# Altium schematic sheet Power.SchDoc
size B
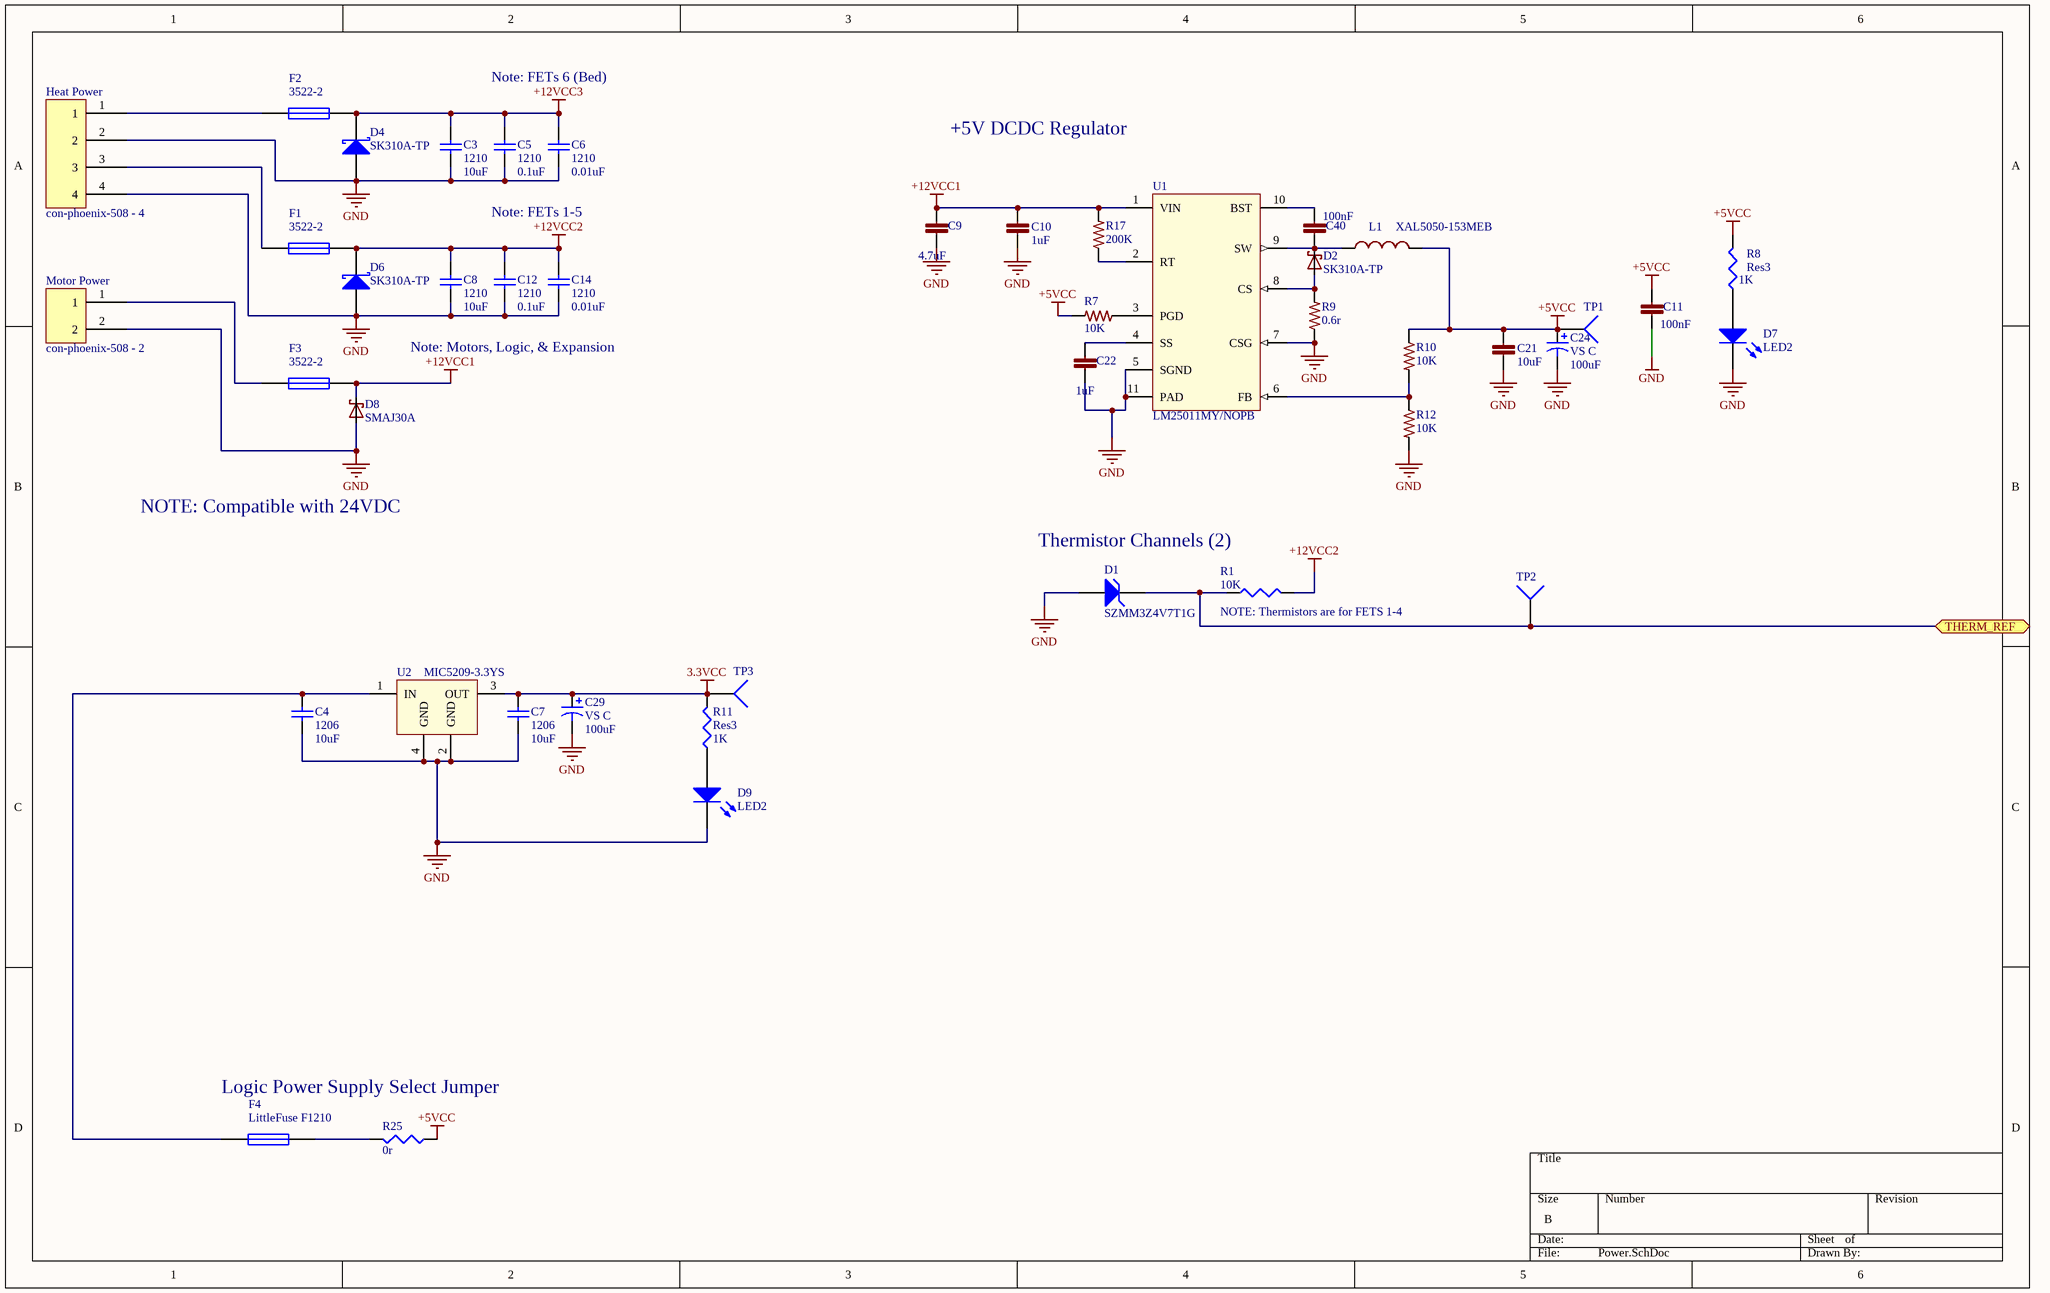
[diagram p0: Power.SchDoc]

## Parts
C3  1210  value 10uF  [C1210]
C4  1206  value 10uF  [C1206]
C5  1210  value 0.1uF  [C1210]
C6  1210  value 0.01uF  [C1210]
C7  1206  value 10uF  [C1206]
C8  1210  value 10uF  [C1210]
C9  4.7uF  [C1206]
C10  1uF  [C0805]
C11  100nF  [C0603]
C12  1210  value 0.1uF  [C1210]
C14  1210  value 0.01uF  [C1210]
C21  10uF  [C0805]
C22  1uF  [C0402]
C24  VS C  value 100uF  [Panasonic VS C]
C29  VS C  value 100uF  [Panasonic VS C]
C40  100nF  [C0603]
D1  SZMM3Z4V7T1G  [SZMM3Z4V7T1G]
D2  SK310A-TP  [SMA-SM]
D4  SK310A-TP  [SK310A-TP]
D6  SK310A-TP  [SK310A-TP]
D7  LED2  [SM 0805 polarized]
D8  SMAJ30A  [SMA-SM]
D9  LED2  [SM 0805 polarized]
F1  3522-2  [3522-2 - WAVE SOLDER]
F2  3522-2  [3522-2 - WAVE SOLDER]
F3  3522-2  [3522-2 - WAVE SOLDER]
F4  LittleFuse F1210  [F1210_M]
Heat_Power  con-phoenix-508 - 4  [MSTBV4]
L1  XAL5050-153MEB  [XAL50xx-153]
Motor_Power  con-phoenix-508 - 2  [MSTBV2 - duplicate]
R1  value 10K  [J1-0603]  (hidden comment: Res3)
R7  10K  [R0603]
R8  Res3  value 1K  [SM 0805 - gap trimmed]
R9  0.6r  [2512R-0.55]
R10  10K  [R0603]
R11  Res3  value 1K  [SM 0805 - gap trimmed]
R12  10K  [R0603]
R17  200K  [R0402]
R25  value 0r  [SM 0805 - gap trimmed]  (hidden comment: Res3)
TP1  TP4  [TP-2]  (value not drawn)
TP2  TP4  [TP-2]  (value not drawn)
TP3  TP4  [TP-2]  (value not drawn)
U1  LM25011MY/NOPB  [VSSOP10]
U2  MIC5209-3.3YS  [SOT230P700X190-4N]

## Ports
THERM_REF

## Nets
3.3VCC: C7.2 C29.1 R11.2 TP3.1 U2.3(OUT)
+5VCC: C11.1 C21.1 C24.1 L1.2 R7.2 R8.2 R10.1 R25.1 TP1.1
+12VCC1: C9.1 C10.1 D8.C F3.2 R17.2 U1.1(VIN)
+12VCC2: C8.2 C12.2 C14.2 D6.2(K) F1.2 R1.2
+12VCC3: C3.2 C5.2 C6.2 D4.2(K) F2.2
GND: C3.1 C4.1 C5.1 C6.1 C7.1 C8.1 C9.2 C10.2 C11.2 C12.1 C14.1 C21.2 C22.2 C24.2 C29.2 D1.1(A) D4.1(A) D6.1(A) D7.1(A) D8.A D9.1(A) Heat_Power.2 Heat_Power.4 Motor_Power.2 R9.1 R12.2 U1.5(SGND) U1.7(CSG) U1.11(PAD) U2.2(GND) U2.4(GND)
THERM_REF: D1.2(K) R1.1 TP2.1 ; port THERM_REF
NetC4_2: C4.2 F4.1 U2.1(IN)
NetC22_1: C22.1 U1.4(SS)
NetC40_1: C40.1 U1.10(BST)
NetC40_2: C40.2 D2.C L1.1 U1.9(SW)
NetD2_A: D2.A R9.2 U1.8(CS)
NetD7_2: D7.2(K) R8.1
NetD9_2: D9.2(K) R11.1
NetF1_1: F1.1 Heat_Power.3
NetF2_1: F2.1 Heat_Power.1
NetF3_1: F3.1 Motor_Power.1
NetF4_2: F4.2 R25.2
NetR7_1: R7.1 U1.3(PGD)
NetR10_2: R10.2 R12.1 U1.6(FB)
NetR17_1: R17.1 U1.2(RT)

## Notes on the sheet
- Note: FETs 6 (Bed)
- +5V DCDC Regulator
- Note: FETs 1-5
- Note: Motors, Logic, & Expansion
- NOTE: Compatible with 24VDC
- Thermistor Channels (2)
- (near R1) NOTE: Thermistors are for FETS 1-4
- Logic Power Supply Select Jumper

## Library data of the parts
C3-C8 C12 C14 = Cap Semi: Capacitor (Semiconductor SIM Model); Published: 8-Jun-2000; LatestRevisionDate: 29-May-2009; LatestRevisionNote: IPC-7351 Footprint Added.; PackageReference: C1206; Publisher: Altium Limited; PackageDescription: Chip Capacitor
C9 = C1206C475K5PACTU: CAP CER 1206 4.7uF 50V 10% X5R; LastRevisionNote: ImportComponents; Published: 23-Apr-2014; Publisher: UltiMachine; LastRevisionDate: 23-Apr-2014; ManufacturerPartNumber: C1206C475K5PACTU; VALUE: 4.7uF
C10 = GRM21BR71H105KA12L: CAP CER 0805 1uF 50V 10% X7R; LastRevisionNote: ImportComponents; Published: 23-Apr-2014; Publisher: UltiMachine; LastRevisionDate: 23-Apr-2014; ManufacturerPartNumber: GRM21BR71H105KA12L; VALUE: 1uF
C11 C40 = C0603C104K5RACTU: CAP CER 0603 100nF 50V 10% X7R; LastRevisionNote: ImportComponents; LastRevisionDate: 23-Apr-2014; ManufacturerPartNumber: C0603C104K5RACTU; Published: 23-Apr-2014; Publisher: UltiMachine; VALUE: 100nF
C21 = C0805C106K8PACTU: CAP CER 0805 10uF 10V 10% X5R; LastRevisionNote: ImportComponents; Published: 23-Apr-2014; Publisher: UltiMachine; LastRevisionDate: 23-Apr-2014; ManufacturerPartNumber: C0805C106K8PACTU; VALUE: 10uF
C22 = GRM155R60J105KE19D: CAP CER 0402 1uF 6.3V 10% X5R; LastRevisionNote: ImportComponents; Published: 23-Apr-2014; Publisher: UltiMachine; LastRevisionDate: 23-Apr-2014; ManufacturerPartNumber: GRM155R60J105KE19D; VALUE: 1uF
C24 C29 = Cap Pol3: Polarized Capacitor (Surface Mount); Published: 8-Jun-2000; LatestRevisionDate: 29-May-2009; LatestRevisionNote: IPC-7351 Footprint Added.; PackageReference: C0805; Publisher: Altium Limited; PackageDescription: Chip Capacitor
D1 = D Zener: Zener Diode; Published: 8-Jun-2000; LatestRevisionDate: 17-Jul-2002; LatestRevisionNote: Re-released for DXP Platform.; PackageReference: DIODE-0.7; Publisher: Altium Limited; PackageDescription: Diode, Thru-Hole; 2 Leads; 0.7 in Pin Spacing
D2 = SK310A: DIODE Schottky 3A SMA; LastRevisionNote: ImportComponents; LastRevisionDate: 23-Apr-2014; ManufacturerPartNumber: SK310A; Published: 23-Apr-2014; Publisher: UltiMachine
D4 D6 = D Schottky: Schottky Diode; Published: 8-Jun-2000; LatestRevisionDate: 17-Jul-2002; LatestRevisionNote: Re-released for DXP Platform.; PackageReference: SMB; Publisher: Altium Limited; PackageDescription: DO-214-AA/SMB; 2 C-Bend Leads; Body 5.3 x 3.6 mm, inc. leads (LxW); Code_JEDEC: DO-214-AA
D7 D9 = LED2: Typical RED, GREEN, YELLOW, AMBER GaAs LED; Published: 8-Jun-2000; LatestRevisionDate: 17-Jul-2002; LatestRevisionNote: Re-released for DXP Platform.; PackageVersion: Feb-2002; PackageReference: 3.2X1.6X1.1; Publisher: Altium Limited; PackageDescription: SM LED; 2 Flat Leads
D8 = SMAJ30A: DIODE TVS 30V SMA; LastRevisionNote: ImportComponents; Published: 23-Apr-2014; Publisher: UltiMachine; LastRevisionDate: 23-Apr-2014; ManufacturerPartNumber: SMAJ30A
F1-F4 = Fuse 1: Fuse; Published: 8-Jun-2000; LatestRevisionDate: 17-Jul-2002; LatestRevisionNote: Re-released for DXP Platform.; PackageReference: PIN-W2/E2.8; Publisher: Altium Limited; PackageDescription: Thru-Hole; 2 Leads
Heat_Power = con-phoenix-508_4
L1 = XAL5050-153MEB: IND 15uH 3.9A 20%; LastRevisionNote: ImportComponents; Published: 23-Apr-2014; Publisher: UltiMachine; LastRevisionDate: 23-Apr-2014; ManufacturerPartNumber: XAL5050-153MEB; Value: XAL5050-153MEB
Motor_Power = con-phoenix-508_2
R1 R8 R11 R25 = Res3: Resistor; Published: 8-Jun-2000; LatestRevisionDate: 29-May-2009; LatestRevisionNote: IPC-7351 Footprint Added.; PackageReference: J1-0603; Publisher: Altium Limited; PackageDescription: Chip Resistor
R7 R10 R12 = ERJ-3EKF1002V: RES 0603 10K 100mW 1%; LastRevisionNote: ImportComponents; Published: 23-Apr-2014; Publisher: UltiMachine; LastRevisionDate: 23-Apr-2014; ManufacturerPartNumber: ERJ-3EKF1002V; VALUE: 10K
R9 = RL2512FK-070R06L: RES 0.06 OHM 1W 1% 2512 SMD; LastRevisionNote: ImportComponents; Published: 23-Apr-2014; Publisher: UltiMachine; LastRevisionDate: 23-Apr-2014; ManufacturerPartNumber: RL2512FK-070R06L; VALUE: 0.6r
R17 = CRCW0402200KFKED: RES 0402 22r 63mW 1%; LastRevisionNote: ImportComponents; Published: 23-Apr-2014; Publisher: UltiMachine; LastRevisionDate: 23-Apr-2014; ManufacturerPartNumber: CRCW0402200KFKED; VALUE: 200K
TP1-TP3 = Socket: LatestRevisionDate: 17-Jul-2002; LatestRevisionNote: Re-released for DXP Platform.; Publisher: Altium Limited
U1 = LM25011: REG BUCK; Value: LM25011MY/NOPB